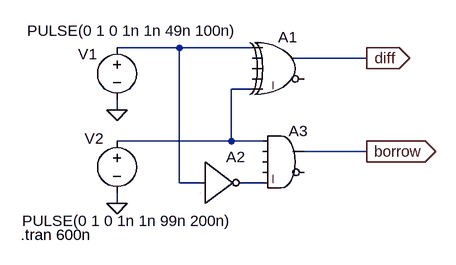
[diagram p0: schematic halfSubtracter.asc]
halfSubtracter.asc, the LTspice schematic file:
Version 4
SHEET 1 880 680
WIRE 112 32 16 32
WIRE 224 32 112 32
WIRE 400 48 288 48
WIRE 224 96 192 96
WIRE 16 128 16 112
WIRE 192 176 192 96
WIRE 192 176 16 176
WIRE 240 176 192 176
WIRE 400 192 304 192
WIRE 112 240 112 32
WIRE 144 240 112 240
WIRE 240 240 208 240
WIRE 16 272 16 256
FLAG 16 128 0
FLAG 16 272 0
FLAG 400 48 diff
IOPIN 400 48 Out
FLAG 400 192 borrow
IOPIN 400 192 Out
SYMBOL voltage 16 16 R0
WINDOW 0 -60 26 Left 2
WINDOW 3 -138 -10 Left 2
WINDOW 123 0 0 Left 0
WINDOW 39 0 0 Left 0
SYMATTR InstName V1
SYMATTR Value PULSE(0 1 0 1n 1n 49n 100n)
SYMBOL voltage 16 160 R0
WINDOW 0 -50 12 Left 2
WINDOW 3 -146 139 Left 2
WINDOW 123 0 0 Left 0
WINDOW 39 0 0 Left 0
SYMATTR InstName V2
SYMATTR Value PULSE(0 1 0 1n 1n 99n 200n)
SYMBOL Digital\\xor 272 0 R0
SYMATTR InstName A1
SYMBOL Digital\\inv 144 176 R0
SYMATTR InstName A2
SYMBOL Digital\\and 272 144 R0
SYMATTR InstName A3
TEXT -132 320 Left 2 !.tran 600n

The netlist it stands for:
* halfSubtracter.asc
V1 N001 0 PULSE(0 1 0 1n 1n 49n 100n)
V2 N002 0 PULSE(0 1 0 1n 1n 99n 200n)
A1 N001 0 0 0 N002 0 diff 0 XOR
A2 N001 0 0 0 0 N003 0 0 BUF
A3 N002 0 0 0 N003 0 borrow 0 AND
.tran 600n
.backanno
.end